# Altium schematic sheet Handle.SchDoc
size A4
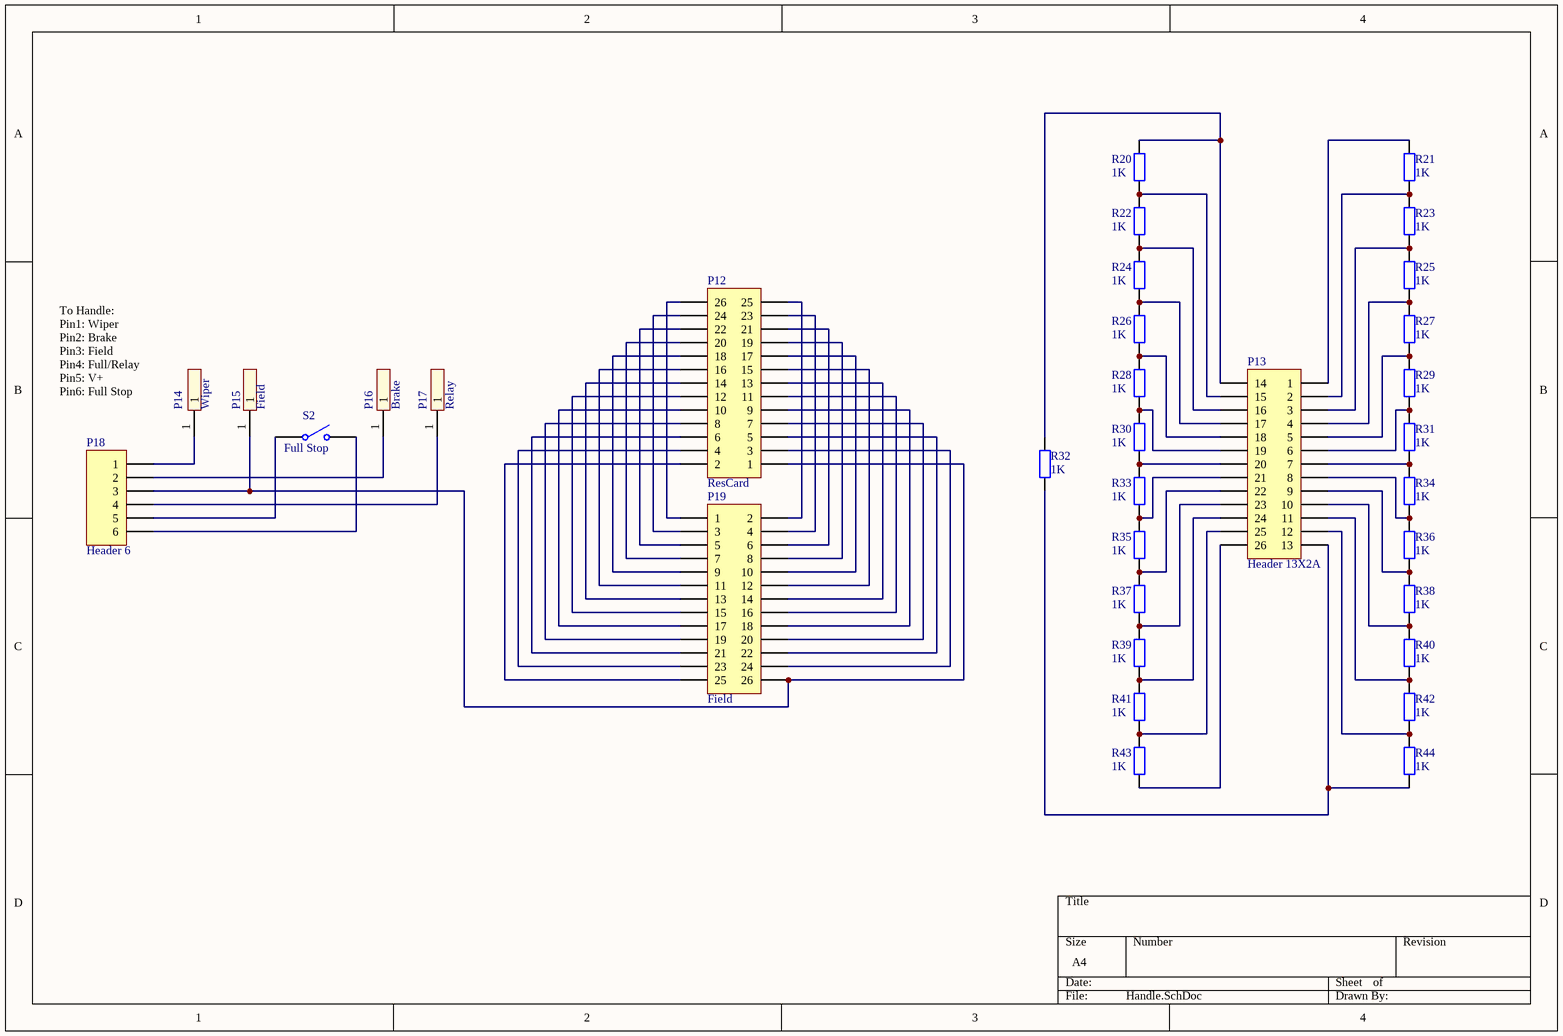
[diagram p0: Handle.SchDoc]

## Parts
P12  ResCard  [HDR2X13]
P13  Header 13X2A  [HDR2X13]
P14  Wiper  [1Pin]
P15  Field  [1Pin]
P16  Brake  [1Pin]
P17  Relay  [1Pin]
P18  Header 6  [Interconnect]
P19  Field  [Wiper Field]
R20  value 1K  [Res Linear]  (hidden comment: Res2)
R21  value 1K  [Res Linear]  (hidden comment: Res2)
R22  value 1K  [Res Linear]  (hidden comment: Res2)
R23  value 1K  [Res Linear]  (hidden comment: Res2)
R24  value 1K  [Res Linear]  (hidden comment: Res2)
R25  value 1K  [Res Linear]  (hidden comment: Res2)
R26  value 1K  [Res Linear]  (hidden comment: Res2)
R27  value 1K  [Res Linear]  (hidden comment: Res2)
R28  value 1K  [Res Linear]  (hidden comment: Res2)
R29  value 1K  [Res Linear]  (hidden comment: Res2)
R30  value 1K  [Res Linear]  (hidden comment: Res2)
R31  value 1K  [Res Linear]  (hidden comment: Res2)
R32  value 1K  [Res Linear]  (hidden comment: Res2)
R33  value 1K  [Res Linear]  (hidden comment: Res2)
R34  value 1K  [Res Linear]  (hidden comment: Res2)
R35  value 1K  [Res Linear]  (hidden comment: Res2)
R36  value 1K  [Res Linear]  (hidden comment: Res2)
R37  value 1K  [Res Linear]  (hidden comment: Res2)
R38  value 1K  [Res Linear]  (hidden comment: Res2)
R39  value 1K  [Res Linear]  (hidden comment: Res2)
R40  value 1K  [Res Linear]  (hidden comment: Res2)
R41  value 1K  [Res Linear]  (hidden comment: Res2)
R42  value 1K  [Res Linear]  (hidden comment: Res2)
R43  value 1K  [Res Linear]  (hidden comment: Res2)
R44  value 1K  [Res Linear]  (hidden comment: Res2)
S2  Full Stop  [HDR1X2]

## Nets
NetP12_1: P12.1 P15.1 P18.3 P19.26
NetP12_2: P12.2 P19.25
NetP12_3: P12.3 P19.24
NetP12_4: P12.4 P19.23
NetP12_5: P12.5 P19.22
NetP12_6: P12.6 P19.21
NetP12_7: P12.7 P19.20
NetP12_8: P12.8 P19.19
NetP12_9: P12.9 P19.18
NetP12_10: P12.10 P19.17
NetP12_11: P12.11 P19.16
NetP12_12: P12.12 P19.15
NetP12_13: P12.13 P19.14
NetP12_14: P12.14 P19.13
NetP12_15: P12.15 P19.12
NetP12_16: P12.16 P19.11
NetP12_17: P12.17 P19.10
NetP12_18: P12.18 P19.9
NetP12_19: P12.19 P19.8
NetP12_20: P12.20 P19.7
NetP12_21: P12.21 P19.6
NetP12_22: P12.22 P19.5
NetP12_23: P12.23 P19.4
NetP12_24: P12.24 P19.3
NetP12_25: P12.25 P19.2
NetP12_26: P12.26 P19.1
NetP13_1: P13.1 R21.1
NetP13_2: P13.2 R21.2 R23.1
NetP13_3: P13.3 R23.2 R25.1
NetP13_4: P13.4 R25.2 R27.1
NetP13_5: P13.5 R27.2 R29.1
NetP13_6: P13.6 R29.2 R31.1
NetP13_7: P13.7 R31.2 R34.1
NetP13_8: P13.8 R34.2 R36.1
NetP13_9: P13.9 R36.2 R38.1
NetP13_10: P13.10 R38.2 R40.1
NetP13_11: P13.11 R40.2 R42.1
NetP13_12: P13.12 R42.2 R44.1
NetP13_13: P13.13 R32.1 R44.2
NetP13_14: P13.14 R20.1 R32.2
NetP13_15: P13.15 R20.2 R22.1
NetP13_16: P13.16 R22.2 R24.1
NetP13_17: P13.17 R24.2 R26.1
NetP13_18: P13.18 R26.2 R28.1
NetP13_19: P13.19 R28.2 R30.1
NetP13_20: P13.20 R30.2 R33.1
NetP13_21: P13.21 R33.2 R35.1
NetP13_22: P13.22 R35.2 R37.1
NetP13_23: P13.23 R37.2 R39.1
NetP13_24: P13.24 R39.2 R41.1
NetP13_25: P13.25 R41.2 R43.1
NetP13_26: P13.26 R43.2
NetP14_1: P14.1 P18.1
NetP16_1: P16.1 P18.2
NetP17_1: P17.1 P18.4
NetP18_5: P18.5 S2.1(COMMON)
NetP18_6: P18.6 S2.2(NO)

## Notes on the sheet
- To Handle:
  Pin1: Wiper
  Pin2: Brake
  Pin3: Field
  Pin4: Full/Relay
  Pin5: V+
  Pin6: Full Stop

## Library data of the parts
P12 P19 = Header 13X2: Header, 13-Pin, Dual row; LatestRevisionDate: 17-Jul-2002; LatestRevisionNote: Re-released for DXP Platform.; Publisher: Altium Limited
P13 = Header 13X2A: Header, 13-Pin, Dual row; LatestRevisionDate: 17-Jul-2002; LatestRevisionNote: Re-released for DXP Platform.; Publisher: Altium Limited
P14 P16 P17 = Component_1
P15 = 1Pin
P18 = Header 6: Header, 6-Pin; LatestRevisionDate: 17-Jul-2002; LatestRevisionNote: Re-released for DXP Platform.; Publisher: Altium Limited
R20-R44 = Res2: Resistor; Published: 8-Jun-2000; LatestRevisionDate: 17-Jul-2002; LatestRevisionNote: Re-released for DXP Platform.; PackageReference: AXIAL-0.4; Publisher: Altium Limited; PackageDescription: Axial Device, Thru-Hole; 2 Leads; 0.4 in Pin Spacing
S2 = SW-SPST: Single-Pole, Single-Throw Switch; Published: 24-Mar-1999; LatestRevisionDate: 17-Jul-2002; LatestRevisionNote: Re-released for DXP Platform.; PackageReference: SPST-2; Publisher: Altium Limited; PackageDescription: Switch; 2 Leads